# Altium schematic sheet SHT1x.SchDoc
size A
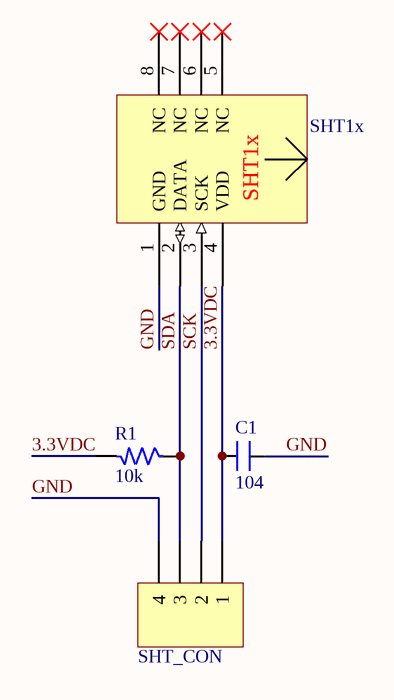
[diagram p0: SHT1x.SchDoc]

## Parts
C1  104  [C0805]
R1  10k  [C0805]
SHT1x  SHT1x  [SHT1x]  (value not drawn)
SHT_CON  SHTCON  [HDR1X4]  (value not drawn)

## Nets
3.3VDC: C1.2 R1.2 SHT1x.4(VDD) SHT_CON.1
GND: C1.1 SHT1x.1(GND) SHT_CON.4
SCK: SHT1x.3(SCK) SHT_CON.2
SDA: R1.1 SHT1x.2(DATA) SHT_CON.3

Not connected (* = marked no-connect by the designer): SHT1x 5(NC)* 6(NC)* 7(NC)* 8(NC)*

## Library data of the parts
C1 = CM: Cap SMD; Value: 103
R1 = R: Resistor 1/4W; Value: R1/4W - 1K
SHT_CON = Header 4: Header, 4-Pin; LatestRevisionDate: 17-Jul-2002; LatestRevisionNote: Re-released for DXP Platform.; Publisher: Altium Limited